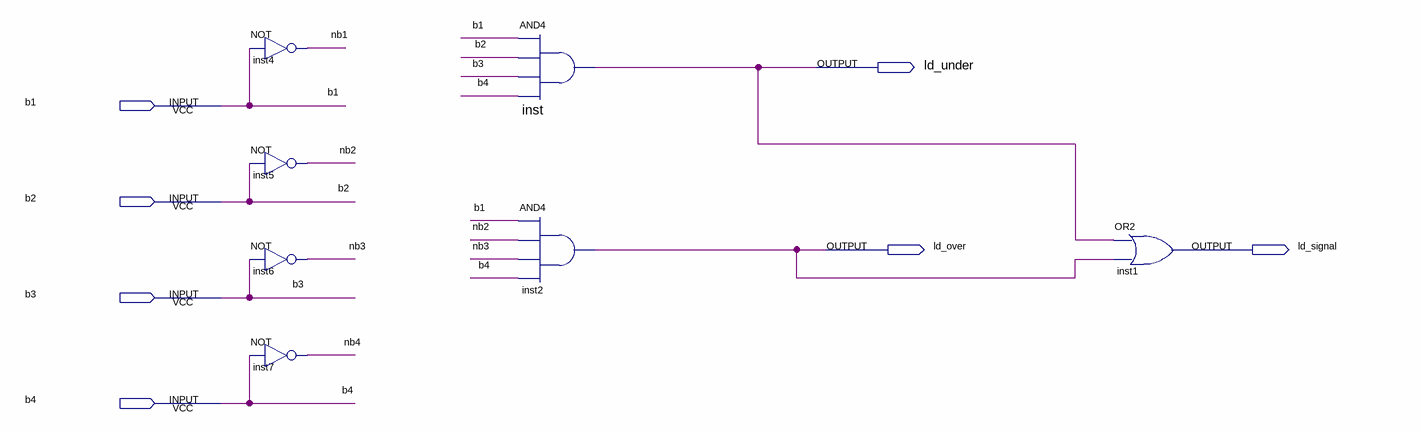
[diagram p0: schematic sheet]
// Quartus schematic load_box.bdf as structural Verilog: 7 symbols, 7 pins
module load_box (
  input  b1,
  input  b2,
  input  b3,
  input  b4,
  output ld_under,
  output ld_over,
  output ld_signal
);

  wire nb1, nb2, nb3, nb4;

  not inst4 (nb1, b1);
  not inst5 (nb2, b2);
  not inst6 (nb3, b3);
  not inst7 (nb4, b4);
  and inst (ld_under, b1, b2, b3, b4);
  and inst2 (ld_over, b1, nb2, nb3, b4);
  or inst1 (ld_signal, ld_under, ld_over);
endmodule
